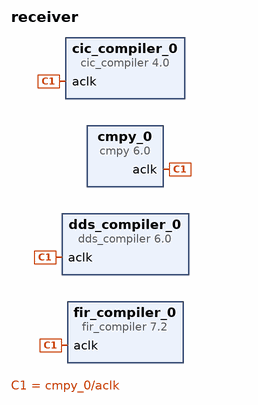
[diagram p0: block diagram of the top level]
# Vivado block design receiver, xc7z020clg484-1, Vivado 2024.1
create_bd_design receiver

create_bd_cell -type ip -vlnv xilinx.com:ip:dds_compiler:6.0 dds_compiler_0
create_bd_cell -type ip -vlnv xilinx.com:ip:cmpy:6.0 cmpy_0
create_bd_cell -type ip -vlnv xilinx.com:ip:cic_compiler:4.0 cic_compiler_0
create_bd_cell -type ip -vlnv xilinx.com:ip:fir_compiler:7.2 fir_compiler_0

# ---- connections ----

connect_bd_net [get_bd_pins cmpy_0/aclk] [get_bd_pins cic_compiler_0/aclk] [get_bd_pins fir_compiler_0/aclk] [get_bd_pins dds_compiler_0/aclk]

validate_bd_design
save_bd_design
